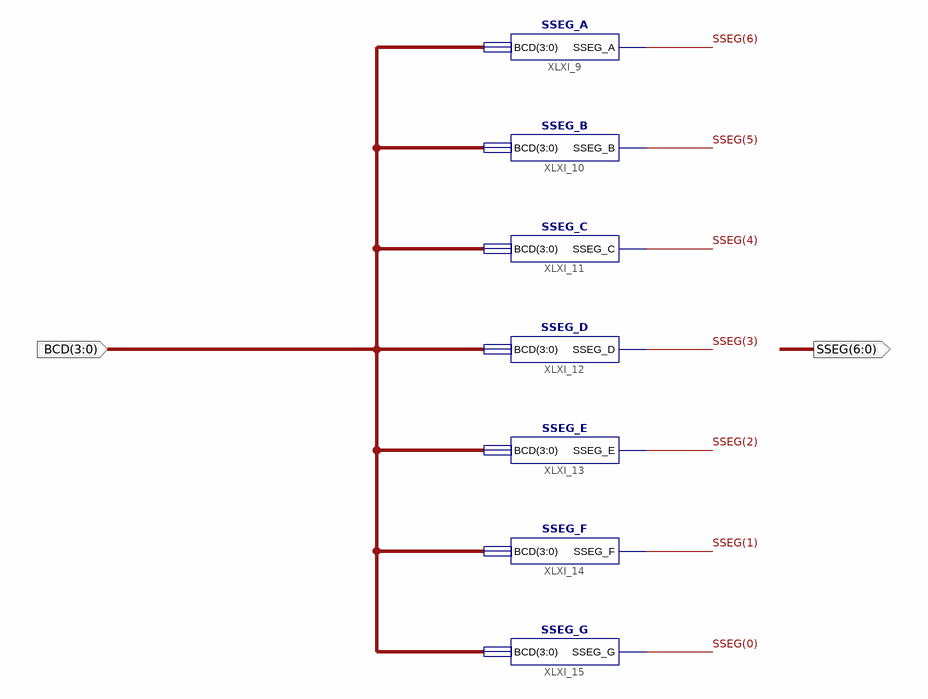
[diagram p0: schematic sheet 1]
// Xilinx ISE schematic SSEG_DEC.sch (spartan6) as structural Verilog: 7 symbols, 2 ports
module SSEG_DEC (
  input  [3:0] BCD,
  output [6:0] SSEG
);

  SSEG_A XLXI_9 (.BCD(BCD), .SSEG_A(SSEG[6]));
  SSEG_B XLXI_10 (.BCD(BCD), .SSEG_B(SSEG[5]));
  SSEG_C XLXI_11 (.BCD(BCD), .SSEG_C(SSEG[4]));
  SSEG_D XLXI_12 (.BCD(BCD), .SSEG_D(SSEG[3]));
  SSEG_E XLXI_13 (.BCD(BCD), .SSEG_E(SSEG[2]));
  SSEG_F XLXI_14 (.BCD(BCD), .SSEG_F(SSEG[1]));
  SSEG_G XLXI_15 (.BCD(BCD), .SSEG_G(SSEG[0]));
endmodule
